# Altium schematic sheet Cover.SchDoc
size A4; SheetNumber: 1; SheetTotal: 8
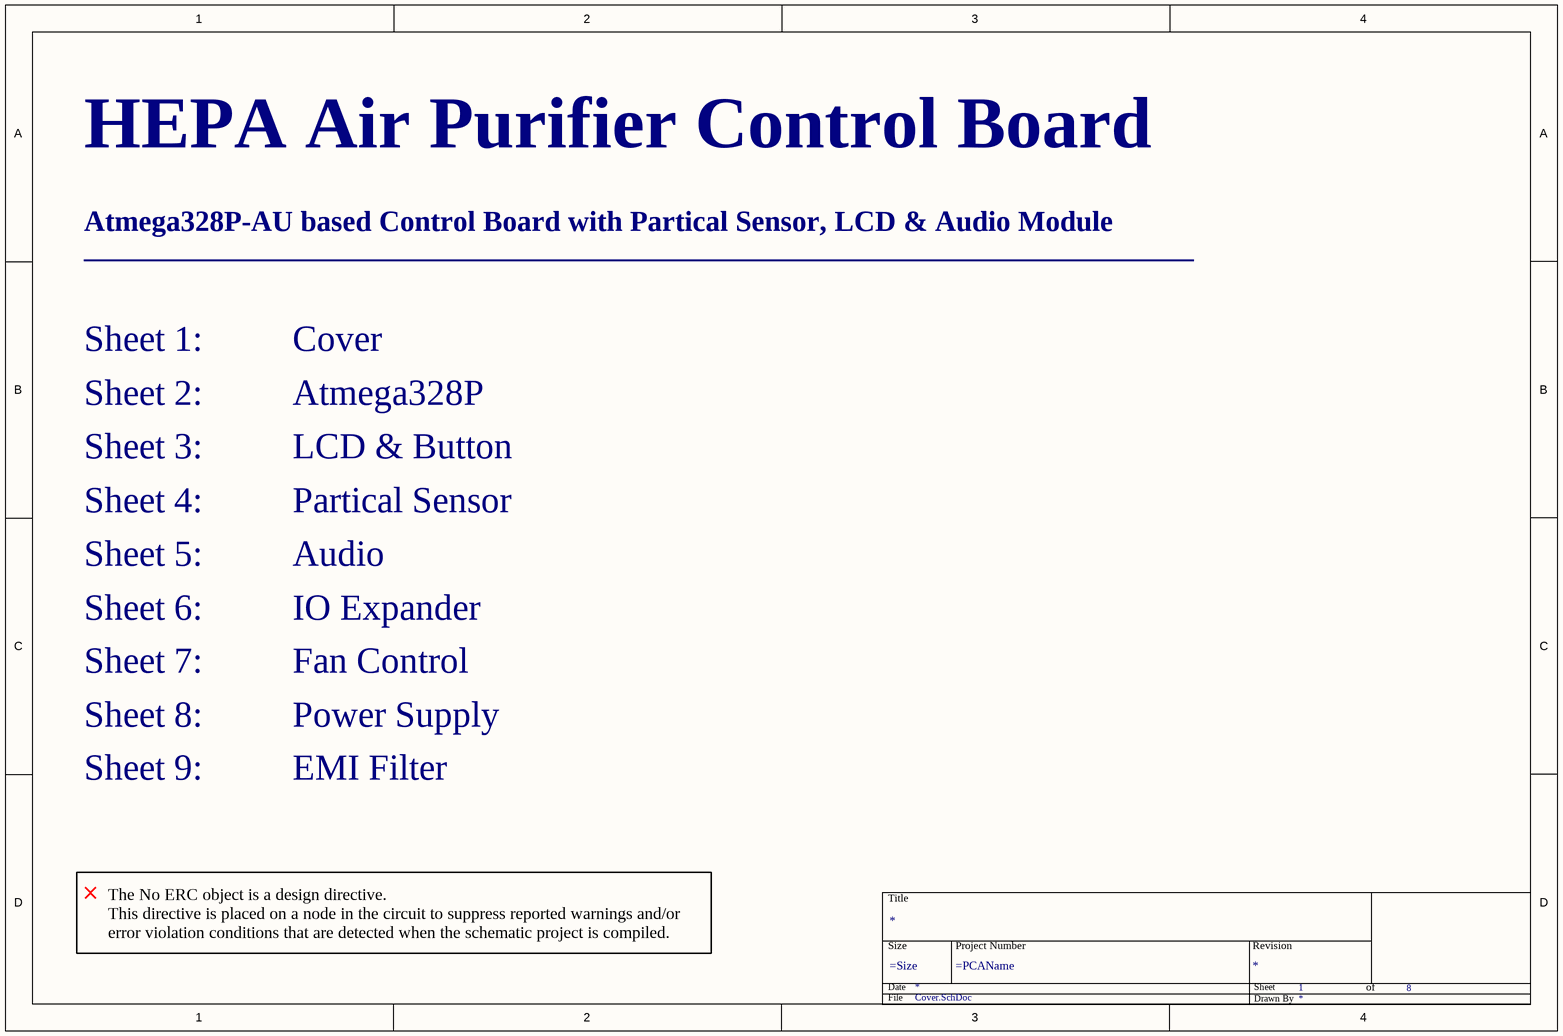
[diagram p0: Cover.SchDoc]

## Parts
*  Title Block  (value not drawn)  (graphical)

## Notes on the sheet
- HEPA Air Purifier Control Board
- Atmega328P-AU based Control Board with Partical Sensor, LCD & Audio Module
- ____________________________________________________________
- Sheet 1:          Cover
- Sheet 2:          Atmega328P
- Sheet 4:          Partical Sensor
- Sheet 3:          LCD & Button
- Sheet 5:          Audio
- Sheet 6:          IO Expander
- Sheet 7:          Fan Control
- Sheet 8:          Power Supply
- Sheet 9:          EMI Filter
- The No ERC object is a design directive.
  This directive is placed on a node in the circuit to suppress reported warnings and/or error violation conditions that are detected when the schematic project is compiled.
- THIS DOCUMENT AND THE DATA DISCLOSED HEREIN OR
- HEREWITH IS THE PROPERTY OF ALTIUM LIMITED AND MAY
- DWG NO:
- REVISION
- REV:
- DESCRIPTION
- DATE
- APPROVED
- BE FREELY DISTRIBUTED IN WHOLE. NO RIGHTS ARE
- RESERVED OR EXPRESS OR IMPLIED WARANTEE GIVEN.
- ENG:
- APPROVALS
- PROJECT
- DSN:
- CHK:
- REFERENCE DOCUMENTS
- PROJECT REVISION:
- TITLE
- DOCUMENT REVISION:
- DESIGN ITEM:
- BOM:
- FAB DWG:
- PCB DWG:
- ASSY DWG:
- SCALE:
- A3
- SIZE
- CAGE CODE
- FILE NAME
- DWG NO.
- SHEET
- OF
- REV
- (in symbol Title Block) Title; Size; Project Number; Revision; Date; Sheet; of; File; Drawn By